# Altium schematic sheet Morpheus_IMU.SchDoc: IMU Motion Detecter
size Letter; CompanyName: Hello Inc.; Organization: Hello Inc.; Revision: DVT; SheetNumber: 3; SheetTotal: 4
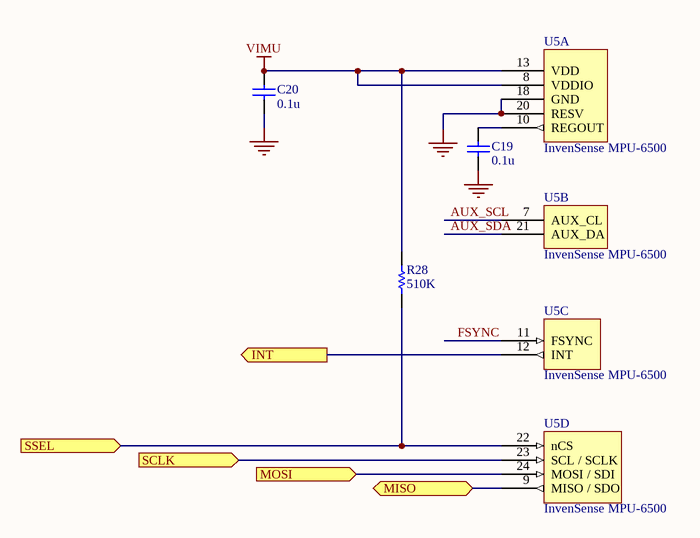
[diagram p0: Morpheus_IMU.SchDoc]

## Parts
C19  0.1u  [CAP0402_SENSE_DVT]
C20  0.1u  [CAP0402_SENSE_DVT]
R28  510K  [RES0402_SENSE_DVT]
U5  InvenSense MPU-6500  [QFN-24]  (parts A,B,C,D of 4)

## Ports
INT (out), MISO, MOSI (in), SCLK (in), SSEL (in)

## Nets
GND: C19.1 C20.1 U5.18(GND) U5.20(RESV)
VIMU: C20.2 R28.2 U5.8(VDDIO) U5.13(VDD)
AUX_SCL: U5.7(AUX_CL)
AUX_SDA: U5.21(AUX_DA)
FSYNC: U5.11(FSYNC)
INT: U5.12(INT) ; port INT
MISO: U5.9(MISO_/_SDO) ; port MISO
MOSI: U5.24(MOSI_/_SDI) ; port MOSI
SCLK: U5.23(SCL_/_SCLK) ; port SCLK
SSEL: R28.1 U5.22(nCS) ; port SSEL
NetC19_2: C19.2 U5.10(REGOUT)

## Notes on the sheet
- TITLE
- DATE
- DRAWN BY
- REV
- SHEET
- OF

## Library data of the parts
C19 C20 = C_0.1u_10_50_X7R_0402: CAP CER 0.1UF 50V 10% X7R 0402; Vendor: Murata; PN: GRM155R71H104KE14D; Hello_PN: 225-00468; item_category: Capacitor; Value: 0.1u; Size: 0402; Tolerance: 10%; Voltage: 50V; Temp: X7R
R28 = R_510K_5_0.1_0402: RES SMD 510K OHM 5%1/16W 0402; Vendor: Yageo; Tolerance: 5 %; Power: 0.1 W; PN: RC0402JR-07510KL; Hello_PN: 220-00466; item_category: Resistor; Model: *; Value: 510K; Size: 0402
U5 = MPU-6500: GYRO/ACCELEROMETER 6AXIS 24QFN; Hello_PN: 265-00025; item_category: IC Mixed Signal; PN: MPU-6500; Vendor: Invensense